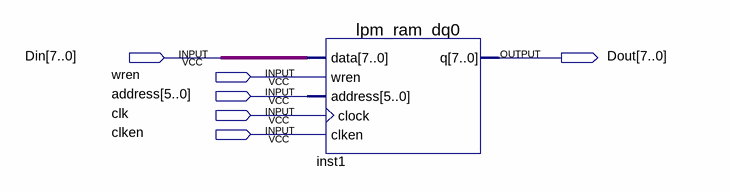
[diagram p0: schematic sheet]
// Quartus schematic SRAM.bdf as structural Verilog: 1 symbols, 6 pins
module SRAM (
  input  [7:0] Din,
  input  wren,
  input  [5:0] address,
  input  clk,
  input  clken,
  output [7:0] Dout
);

  lpm_ram_dq0 inst1 (.data(Din), .wren(wren), .address(address), .clock(clk), .clken(clken), .q(Dout));
endmodule
